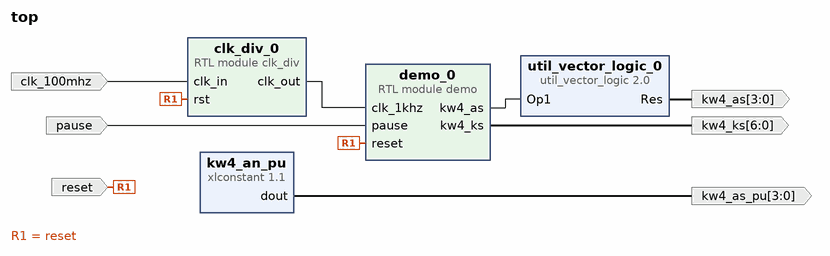
[diagram p0: block diagram of the top level]
# Vivado block design top, xc7a100tcsg324-1, Vivado 2019.1
create_bd_design top

create_bd_port -dir I -type rst reset
create_bd_port -dir I pause
create_bd_port -dir I clk_100mhz
create_bd_port -dir O -from 3 -to 0 kw4_as
create_bd_port -dir O -from 3 -to 0 kw4_as_pu
create_bd_port -dir O -from 6 -to 0 kw4_ks

create_bd_cell -type module -reference demo demo_0
create_bd_cell -type module -reference clk_div clk_div_0
set_property -dict {CONFIG.DIV 100000} [get_bd_cells clk_div_0]
create_bd_cell -type ip -vlnv xilinx.com:ip:xlconstant:1.1 kw4_an_pu
set_property -dict {CONFIG.CONST_VAL 0b1111 CONFIG.CONST_WIDTH 4} [get_bd_cells kw4_an_pu]
create_bd_cell -type ip -vlnv xilinx.com:ip:util_vector_logic:2.0 util_vector_logic_0
set_property -dict {CONFIG.C_OPERATION not CONFIG.C_SIZE 4} [get_bd_cells util_vector_logic_0]

# ---- connections ----

connect_bd_net [get_bd_pins clk_div_0/clk_out] [get_bd_pins demo_0/clk_1khz]
connect_bd_net -net rst_0_1 [get_bd_ports reset] [get_bd_pins clk_div_0/rst] [get_bd_pins demo_0/reset]
connect_bd_net -net pause_0_1 [get_bd_ports pause] [get_bd_pins demo_0/pause]
connect_bd_net -net clk_in_0_1 [get_bd_ports clk_100mhz] [get_bd_pins clk_div_0/clk_in]
connect_bd_net [get_bd_pins util_vector_logic_0/Res] [get_bd_ports kw4_as]
connect_bd_net [get_bd_pins demo_0/kw4_as] [get_bd_pins util_vector_logic_0/Op1]
connect_bd_net [get_bd_pins kw4_an_pu/dout] [get_bd_ports kw4_as_pu]
connect_bd_net [get_bd_pins demo_0/kw4_ks] [get_bd_ports kw4_ks]

validate_bd_design
save_bd_design
